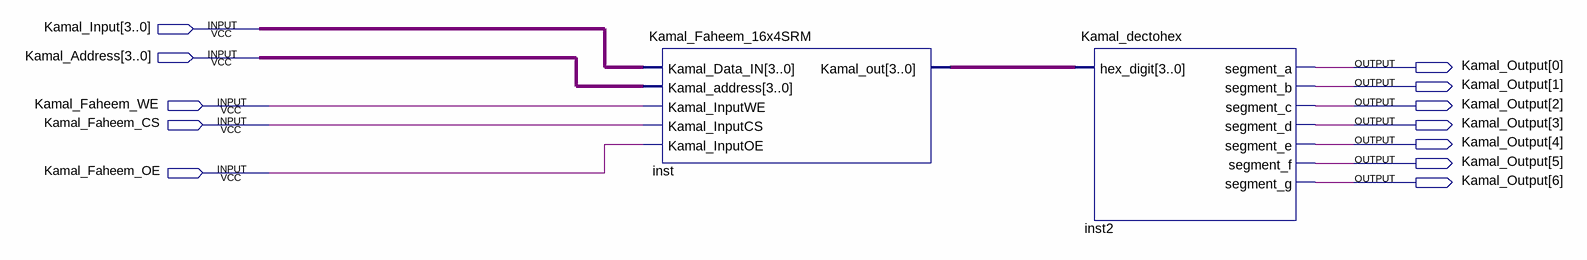
[diagram p0: schematic sheet]
// Quartus schematic Kamal_Faheem_16x4SRAMwithDectoHex.bdf as structural Verilog: 2 symbols, 12 pins
module Kamal_Faheem_16x4SRAMwithDectoHex (
  input  [3:0] Kamal_Input,
  input  [3:0] Kamal_Address,
  input  Kamal_Faheem_WE,
  input  Kamal_Faheem_CS,
  input  Kamal_Faheem_OE,
  output [6:0] Kamal_Output
);

  wire [3:0] inst_kamal_out;

  Kamal_Faheem_16x4SRM inst (
    .Kamal_Data_IN(Kamal_Input), .Kamal_address(Kamal_Address), .Kamal_InputWE(Kamal_Faheem_WE),
    .Kamal_InputCS(Kamal_Faheem_CS), .Kamal_InputOE(Kamal_Faheem_OE), .Kamal_out(inst_kamal_out));
  Kamal_dectohex inst2 (
    .hex_digit(inst_kamal_out), .segment_a(Kamal_Output[0]), .segment_b(Kamal_Output[1]),
    .segment_c(Kamal_Output[2]), .segment_d(Kamal_Output[3]), .segment_e(Kamal_Output[4]),
    .segment_f(Kamal_Output[5]), .segment_g(Kamal_Output[6]));
endmodule
